# EAGLE design pentalight_2layer (EAGLE 5.11)
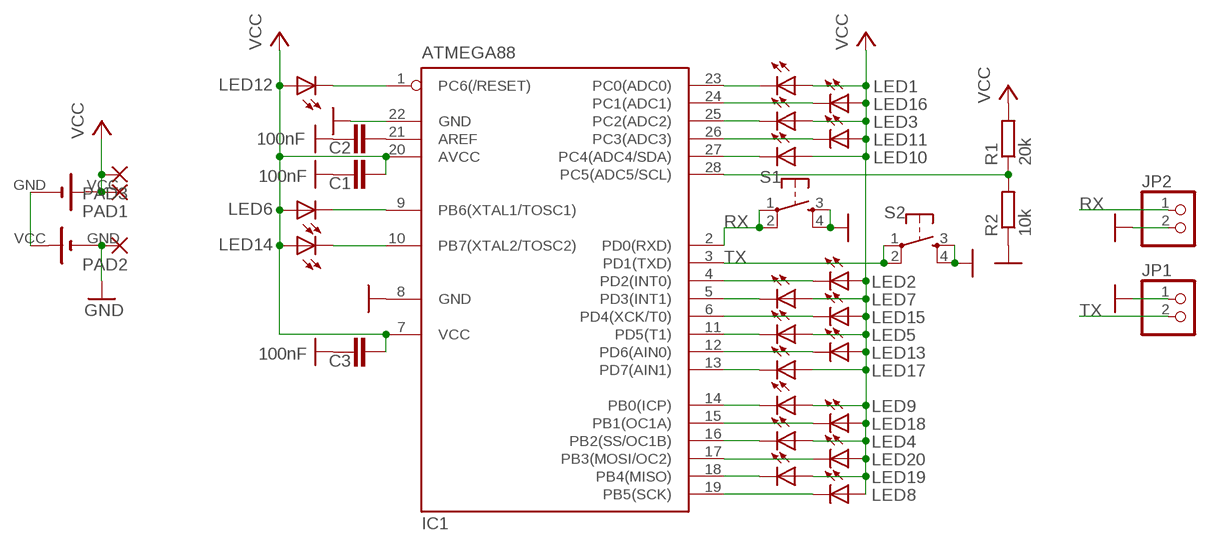
[diagram p0: schematic, sheet 1]

## Parts
B1  AAA_PRINT  [AAA]
B2  AAA_PRINT  [AAA]
C1  100nF  C-EU025-024X044  [C025-024X044]
C2  100nF  C-EU025-024X044  [C025-024X044]
C3  100nF  C-EU025-024X044  [C025-024X044]
IC1  ATMEGA88  MEGA8-P  [DIL28-3]
JP1  PINHD-1X2  [1X02]
JP2  PINHD-1X2  [1X02]
LED1  LED5MM  [LED5MM]
LED2  LED5MM  [LED5MM]
LED3  LED5MM  [LED5MM]
LED4  LED5MM  [LED5MM]
LED5  LED5MM  [LED5MM]
LED6  LED5MM  [LED5MM]
LED7  LED5MM  [LED5MM]
LED8  LED5MM  [LED5MM]
LED9  LED5MM  [LED5MM]
LED10  LED5MM  [LED5MM]
LED11  LED5MM  [LED5MM]
LED12  LED5MM  [LED5MM]
LED13  LED5MM  [LED5MM]
LED14  LED5MM  [LED5MM]
LED15  LED5MM  [LED5MM]
LED16  LED5MM  [LED5MM]
LED17  LED5MM  [LED5MM]
LED18  LED5MM  [LED5MM]
LED19  LED5MM  [LED5MM]
LED20  LED5MM  [LED5MM]
PAD1  2,54/1,1  [2,54/1,1]
PAD2  2,54/1,1  [2,54/1,1]
PAD3  2,54/1,1  [2,54/1,1]
R1  20k  R-EU_0207/10  [0207/10]
R2  10k  R-EU_0207/10  [0207/10]
S1  TAC_SWITCHPTH  [TACTILE-PTH]
S2  TAC_SWITCHPTH  [TACTILE-PTH]

## Nets
GND: B1.GND(-) C1.1 C2.1 C3.1 IC1.8(GND) IC1.22(GND) JP1.1 JP2.2 PAD2.1(P) R2.1 S1.3 S1.4 S2.3 S2.4
N$1: IC1.18(PB4(MISO)) LED19.K(C)
N$2: IC1.17(PB3(MOSI/OC2)) LED20.K(C)
N$3: IC1.23(PC0(ADC0)) LED1.K(C)
N$4: IC1.4(PD2(INT0)) LED2.K(C)
N$5: IC1.25(PC2(ADC2)) LED3.K(C)
N$6: IC1.16(PB2(SS/OC1B)) LED4.K(C)
N$7: IC1.11(PD5(T1)) LED5.K(C)
N$8: IC1.9(PB6(XTAL1/TOSC1)) LED6.K(C)
N$9: IC1.5(PD3(INT1)) LED7.K(C)
N$10: IC1.19(PB5(SCK)) LED8.K(C)
N$11: IC1.14(PB0(ICP)) LED9.K(C)
N$12: IC1.26(PC3(ADC3)) LED11.K(C)
N$13: IC1.27(PC4(ADC4/SDA)) LED10.K(C)
N$14: IC1.1(PC6(/RESET)) LED12.K(C)
N$15: B1.VCC(+) B2.GND(-)
N$16: IC1.10(PB7(XTAL2/TOSC2)) LED14.K(C)
N$17: C2.2 IC1.21(AREF)
N$18: IC1.24(PC1(ADC1)) LED16.K(C)
N$19: IC1.13(PD7(AIN1)) LED17.K(C)
N$20: IC1.15(PB1(OC1A)) LED18.K(C)
N$21: IC1.12(PD6(AIN0)) LED13.K(C)
N$22: IC1.6(PD4(XCK/T0)) LED15.K(C)
N$23: IC1.28(PC5(ADC5/SCL)) R1.1 R2.2
RX: IC1.2(PD0(RXD)) JP2.1 S1.1 S1.2
TX: IC1.3(PD1(TXD)) JP1.2 S2.1 S2.2
VCC: B2.VCC(+) C1.2 C3.2 IC1.7(VCC) IC1.20(AVCC) LED1.A LED2.A LED3.A LED4.A LED5.A LED6.A LED7.A LED8.A LED9.A LED10.A LED11.A LED12.A LED13.A LED14.A LED15.A LED16.A LED17.A LED18.A LED19.A LED20.A PAD1.1(P) PAD3.1(P) R1.2

## Library data of the parts
B1 B2 = seb:AAA_PRINT
C1-C3 = resistor:C-EU: CAPACITOR, European symbol
IC1 = atmel:MEGA8-P: MICROCONTROLLER 8 Kbytes FLASH, 1 kbytes SRAM, 512 bytes EEPROM, USART, 4-channel 10 bit ADC, 2-channel 8 bit ADC Pin compatible with Atmega48, ATMega88, ATMega168 Source: avr.lbr; OC_FARNELL: unknown; OC_NEWARK: unknown
JP1 JP2 = pinhead:PINHD-1X2: PIN HEADER
LED1-LED20 = SparkFun:LED: LEDs Standard schematic elements and footprints for 5mm, 3mm, 1206, and 0603 sized LEDs. 5mm - Spark Fun Electronics SKU : COM-00529 (and others)
PAD1-PAD3 = wirepad:2,54/1,1: THROUGH-HOLE PAD
R1 R2 = rcl:R-EU_: RESISTOR, European symbol
S1 S2 = SparkFun:TAC_SWITCH: Momentary Switch Button commonly used for reset or general input. Spark Fun Electronics SKU : COM-00097

## Board
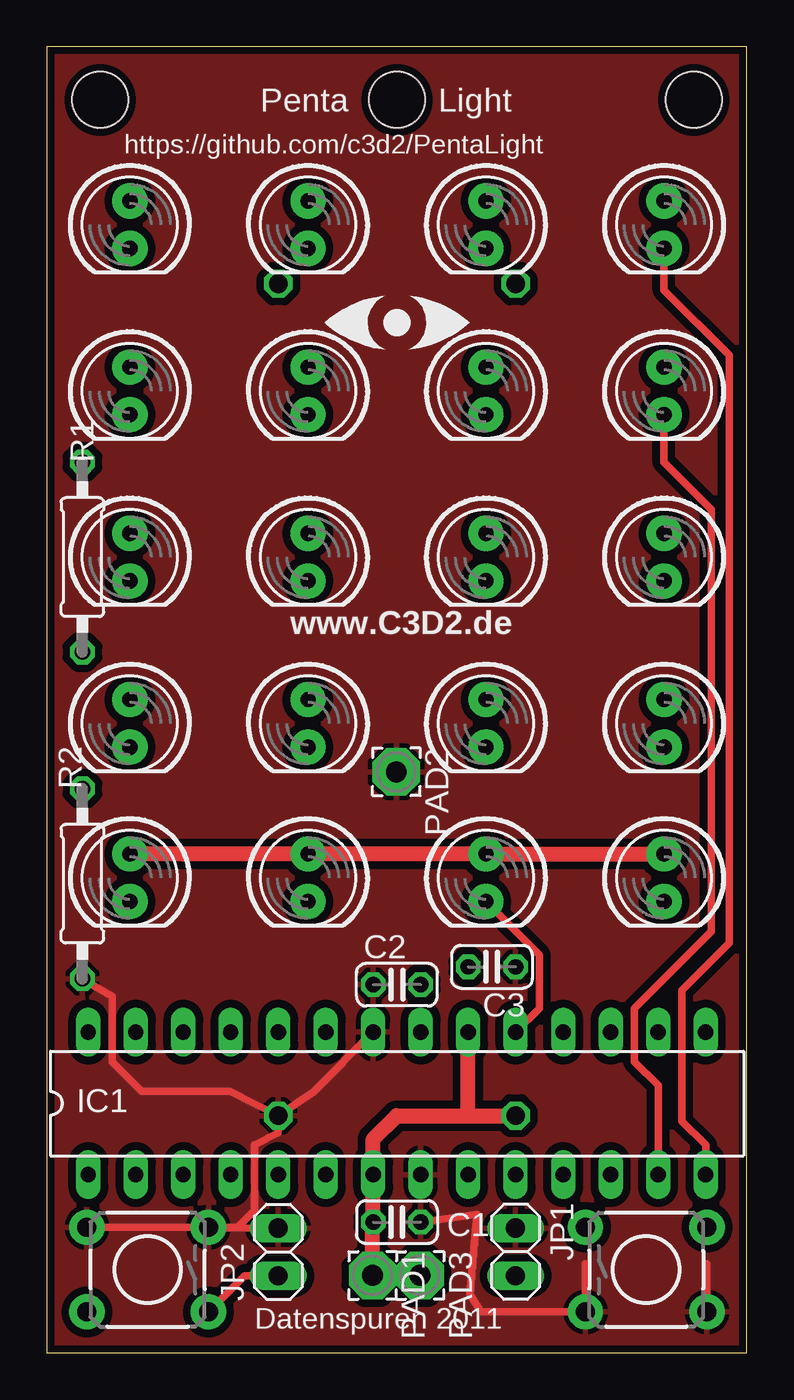
[diagram p1: board, top side]
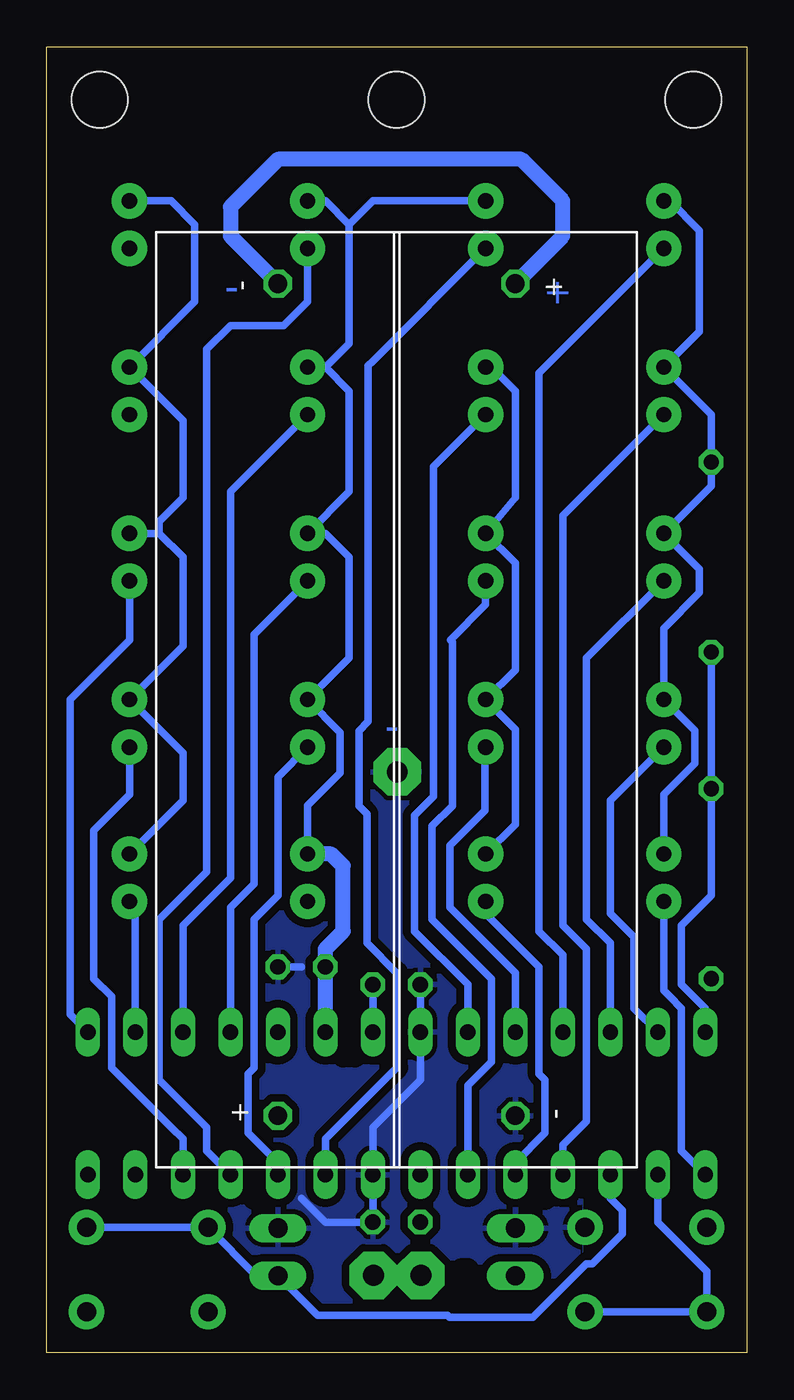
[diagram p2: board, bottom side, seen from below]

Size 37.45 x 69.84 mm. Coordinates in mm from the lower left corner, seen from the top.
Outline: 0,0 37.45,0 37.45,69.84 0,69.84 0,0
Copper layers (1*16): Top 0.035mm / dielectric 1.5mm / Bottom 0.035mm
Design rules "default *": minimum track width 10mil, minimum drill 24mil, track to track 16mil, track to pad 16mil, pad to pad 16mil, via to via 16mil, smd to smd 8mil, copper to edge 15mil, drill to drill 8mil, minimum pad ring 10mil, minimum via ring 8mil, stop-mask expansion 4mil, vias tented up to drill 190mil, thermal gap 10mil
Holes 3 mm at 2.86,66.99 34.61,66.99 18.73,66.99
bRestrict: 4 lines

### Footprints (pad centres in the part's own frame; a part is rotated, then mirrored left to right if it is on the bottom)
AAA = drill 1 octagon: GND 22.25,0; VCC -22.25,0
C025-024X044 = drill 0.813 octagon: 1 -1.27,0; 2 1.27,0
DIL28-3 = drill 0.813 long: 1 -16.51,-3.81; 2 -13.97,-3.81; 3 -11.43,-3.81; 4 -8.89,-3.81; 5 -6.35,-3.81; 6 -3.81,-3.81; 7 -1.27,-3.81; 8 1.27,-3.81; 9 3.81,-3.81; 10 6.35,-3.81; 11 8.89,-3.81; 12 11.43,-3.81; 13 13.97,-3.81; 14 16.51,-3.81; 15 16.51,3.81; 16 13.97,3.81; 17 11.43,3.81; 18 8.89,3.81; 19 6.35,3.81; 20 3.81,3.81; 21 1.27,3.81; 22 -1.27,3.81; 23 -3.81,3.81; 24 -6.35,3.81; 25 -8.89,3.81; 26 -11.43,3.81; 27 -13.97,3.81; 28 -16.51,3.81
1X02 = drill 1.016 long: 1 -1.27,0; 2 1.27,0
LED5MM = drill 0.813 pad 1.88 round: A -1.27,0; K 1.27,0
2,54/1,1 = drill 1.118 pad 2.54 octagon: 1 0,0
0207/10 = drill 0.813 octagon: 1 -5.08,0; 2 5.08,0
TACTILE-PTH = drill 1.016 pad 1.88 round: 1 -3.251,2.261; 2 3.251,2.261; 3 -3.251,-2.261; 4 3.251,-2.261

### Placement (x,y rotation side)
B1  12.38,34.92 270 bottom
B2  25.08,34.92 90 bottom
C1  18.73,6.99 180 top
C2  18.73,19.68 0 top
C3  23.81,20.64 180 top
IC1  18.73,13.34 0 top
JP1  25.08,5.4 270 top
JP2  12.38,5.4 90 top
LED1  13.97,51.44 270 top
LED2  4.45,51.44 270 top
LED3  4.45,60.33 270 top
LED4  33.02,25.4 270 top
LED5  23.5,60.33 270 top
LED6  13.97,60.33 270 top
LED7  13.97,25.4 270 top
LED8  23.5,25.4 270 top
LED9  33.02,60.33 270 top
LED10  4.45,33.66 270 top
LED11  4.45,42.55 270 top
LED12  4.45,25.4 270 top
LED13  33.02,33.66 270 top
LED14  23.5,33.66 270 top
LED15  13.97,42.55 270 top
LED16  13.97,33.66 270 top
LED17  33.02,51.44 270 top
LED18  33.02,42.55 270 top
LED19  23.5,42.55 270 top
LED20  23.5,51.44 270 top
PAD1  17.43,4.14 270 top
PAD2  18.7,31.06 270 top
PAD3  19.97,4.14 270 top
R1  1.91,42.55 90 top
R2  1.91,25.08 90 top
S1  5.4,4.45 180 top
S2  32.07,4.45 0 top

### Tracks (layer width: path | path; a pad name or v marks a point on that pad's centre or on a via)
GND
  Top 0.406: B1.GND 14.26,13.95 IC1.22 | R2.1 3.49,19.05 3.49,15.56 5.08,13.97 9.82,13.97 B1.GND | B1.GND 12.38,11.75 11.11,11.11 11.11,7.62 10.2,6.71 S1.3 7.62,6.71 | 7.62,6.71 7.34,6.71 | S1.4 5.4,6.71 | 5.4,6.71 7.62,6.71 | 5.4,6.71 JP2.2 | C1.1 23,7.4 22.64,3.13 23.22,2.18 S2.3 28.82,4.76 | S2.4 35.32,4.76
  Bottom 0.406: C2.1 IC1.22 17.46,14.61 20,12.06 IC1.8 C1.1 22.54,6.99 23.81,8.26 | C3.1 23.81,20.64
  pour Top (isolate 0.406): -0.32,0 37.78,0 37.78,71.75 -0.32,71.75
  pour Bottom (isolate 0.406): 8.89,32.38 27.62,32.38 27.62,2.08 8.89,1.76
N$1
  Bottom 0.406: LED19.K 26.35,38.42 26.35,25.08 27.62,23.81 IC1.18
N$2
  Bottom 0.406: LED20.K 27.62,46.04 27.62,25.4 30.16,22.86 IC1.17
N$3
  Bottom 0.406: LED1.K 16.57,47.57 16.75,47.38 16.75,29.75 17.78,28.72 17.78,22.54 14.92,19.68 IC1.23
N$4
  Bottom 0.406: LED2.K 9.84,44.77 9.84,22.86 8.57,21.59 8.57,15.43 8.57,12.38 9.84,11.11 IC1.4
N$5
  Bottom 0.406: LED3.K 11.11,52.39 11.11,22.54 9.84,21.27 IC1.25
N$6
  Bottom 0.406: LED4.K 32.7,23.81 IC1.16
N$7
  Bottom 0.406: LED5.K 23.5,56.2 24.77,54.93 27.3,54.93 27.62,54.93 28.89,53.66 28.89,25.72 31.43,23.18 31.43,15.56 31.43,14.61 28.89,12.06 28.89,10.79 IC1.11
N$8
  Bottom 0.406: IC1.9 22.54,11.43 18.73,15.24 18.73,20.32 20.32,21.91 20.32,28.82 20.5,29 20.75,29.25 20.75,33.25 20.25,33.75 20.25,52.77 20,53.02 LED6.K
N$9
  Bottom 0.406: LED7.K 13.97,23.5 11.11,20.64 11.11,14.92 10.79,14.61 10.79,11.75 12.38,10.16 IC1.5
N$10
  Top 0.406: LED8.K 26.35,21.27 26.35,18.41 IC1.19
N$11
  Top 0.406: LED9.K 33.02,56.83 36.51,53.34 36.51,21.91 33.97,19.37 33.97,12.38 35.24,11.11 IC1.14
N$12
  Bottom 0.406: LED11.K 8.57,37.15 8.57,23.18 7.3,21.91 IC1.26
N$13
  Bottom 0.406: LED10.K 7.3,29.53 7.3,23.5 6.03,22.23 6.03,20.95 6.03,18.41 IC1.27
N$14
  Bottom 0.406: LED12.K 4.45,22.54 4.45,21.91 4.45,19.37 4.13,19.05 3.49,18.41 3.49,10.79 IC1.1
N$15
  Bottom 0.813: B1.VCC 9.84,59.72 9.84,61.59 12.06,63.82 25.08,63.82 27.62,61.28 27.62,59.72 B2.GND
N$16
  Bottom 0.406: LED14.K 25.08,30.8 25.08,24.45 26.35,23.18 26.35,15.24 26.67,14.92 26.67,11.75 26.35,11.43 25.08,10.16 IC1.10
N$17
  Bottom 0.406: C2.2 20,17.78 IC1.21
N$18
  Bottom 0.406: IC1.24 12.38,20.32 15.88,23.81 15.88,27.12 14,29 14,32.35 LED16.K
N$19
  Top 0.406: LED17.K 33.02,47.62 35.56,45.09 35.56,22.54 31.43,18.41 31.43,15.56 32.7,14.29 IC1.13
N$20
  Bottom 0.406: LED18.K 33.02,38.1 35.24,35.88 36.2,34.92 36.2,21.91 36.2,18.1 IC1.15
N$21
  Bottom 0.406: LED13.K 33.02,29.84 34.92,27.94 34.92,20 33.97,19.05 33.97,15.24 30.8,12.06 30.16,11.43 IC1.12
N$22
  Bottom 0.406: LED15.K 13.97,40.01 15.86,38.11 15.75,38 15.75,29.25 16.83,28.17 16.83,23.18 13.65,20 13.65,15.56 14.92,14.29 IC1.6
N$23
  Bottom 0.406: IC1.28 2.22,18.41 3.49,19.68 3.49,22.86 2.22,24.13 1.91,24.45 R2.2 R1.1
RX
  Top 0.406: JP2.1 10.59,4.13 S1.1
  Bottom 0.406: IC1.2 4.76,6.99 2.22,4.45 2.15,4.37 S1.2 | S1.2 2.18,2.22 | S1.2 S1.1
TX
  Bottom 0.406: S2.2 S2.1 26.24,4.13 JP1.2 22.95,2 16,2 15.9,1.91 11.43,1.91 8.57,4.76 8.26,4.76 6.67,6.35 6.67,7.62 7.3,8.26 IC1.3
VCC
  Top 0.813: 22.54,12.68 18.71,12.68 17.46,11.43 IC1.7 C1.2 17.43,6.99 PAD1.1 | 22.54,12.68 B2.VCC | 22.54,12.68 IC1.20 | LED12.A 7.3,26.67 LED7.A LED8.A LED4.A
  Bottom 0.406: 31.43,43.81 30.16,42.55 30.16,37.78 LED13.A 30.16,32.07 30.16,29.53 LED4.A | 31.43,43.81 LED18.A | 31.43,43.81 31.43,44.45 30.16,45.72 30.16,49.85 LED17.A 29.53,56.2 29.53,60.33 30.8,61.59 LED9.A | 22.54,52.7 21.27,53.98 21.27,60.33 | 22.54,52.7 21.27,51.44 21.27,46.04 LED19.A 22.54,43.81 21.27,42.55 21.27,37.15 LED14.A 21.75,33.18 21.75,31 23.5,29.25 LED8.A | 22.54,52.7 LED20.A | LED3.A 4.13,61.59 2.54,60.01 2.54,54.61 LED2.A 1.91,50.16 R1.2 1.91,46.35 LED11.A 3.17,42.55 2.54,41.91 2.54,40.64 4.45,38.73 LED10.A 2.79,33.27 2.79,31.5 4.45,29.84 LED12.A | LED1.A 13.65,52.7 12.38,51.44 12.38,45.72 LED15.A 12.38,42.23 12.38,36.51 LED16.A 12.38,33.34 12.38,28.26 LED7.A | 21.27,60.33 22.54,61.59 LED5.A | PAD1.1 PAD3.1 | LED6.A 18.73,61.59 20,61.59 21.27,60.33
  Bottom 0.813: IC1.20 C3.2 | C3.2 22.54,21.59 | 22.54,21.59 21.59,22.54 21.59,26.04 22.23,26.67 LED8.A | C3.2 22.54,21.59

### Text on the board
Bottom: + | - | -
tPlace: Penta | Light | https://github.com/c3d2/PentaLight | Datenspuren 2011
tNames: www.C3D2.de
bStop: + | - | - | - | + | +